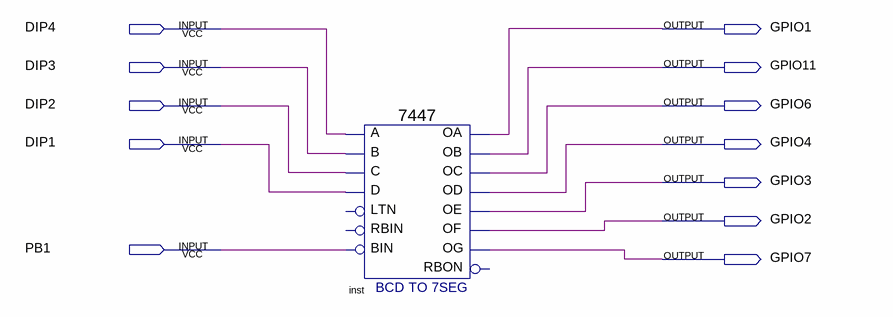
[diagram p0: schematic sheet]
// Quartus schematic circuitoFigura1_modificado.bdf as structural Verilog: 1 symbols, 12 pins
module circuitoFigura1_modificado (
  input  DIP4,
  input  DIP3,
  input  DIP2,
  input  DIP1,
  input  PB1,
  output GPIO1,
  output GPIO11,
  output GPIO6,
  output GPIO4,
  output GPIO3,
  output GPIO2,
  output GPIO7
);

  \7447  inst (
    .B(DIP3), .C(DIP2), .D(DIP1), .BIN(PB1), .A(DIP4), .OB(GPIO11), .OC(GPIO6), .OE(GPIO3), .OD(GPIO4),
    .OF(GPIO2), .OG(GPIO7), .OA(GPIO1));  // open: LTN, RBIN, RBON
endmodule
